# EAGLE design 1Coil (EAGLE 9.2.2)
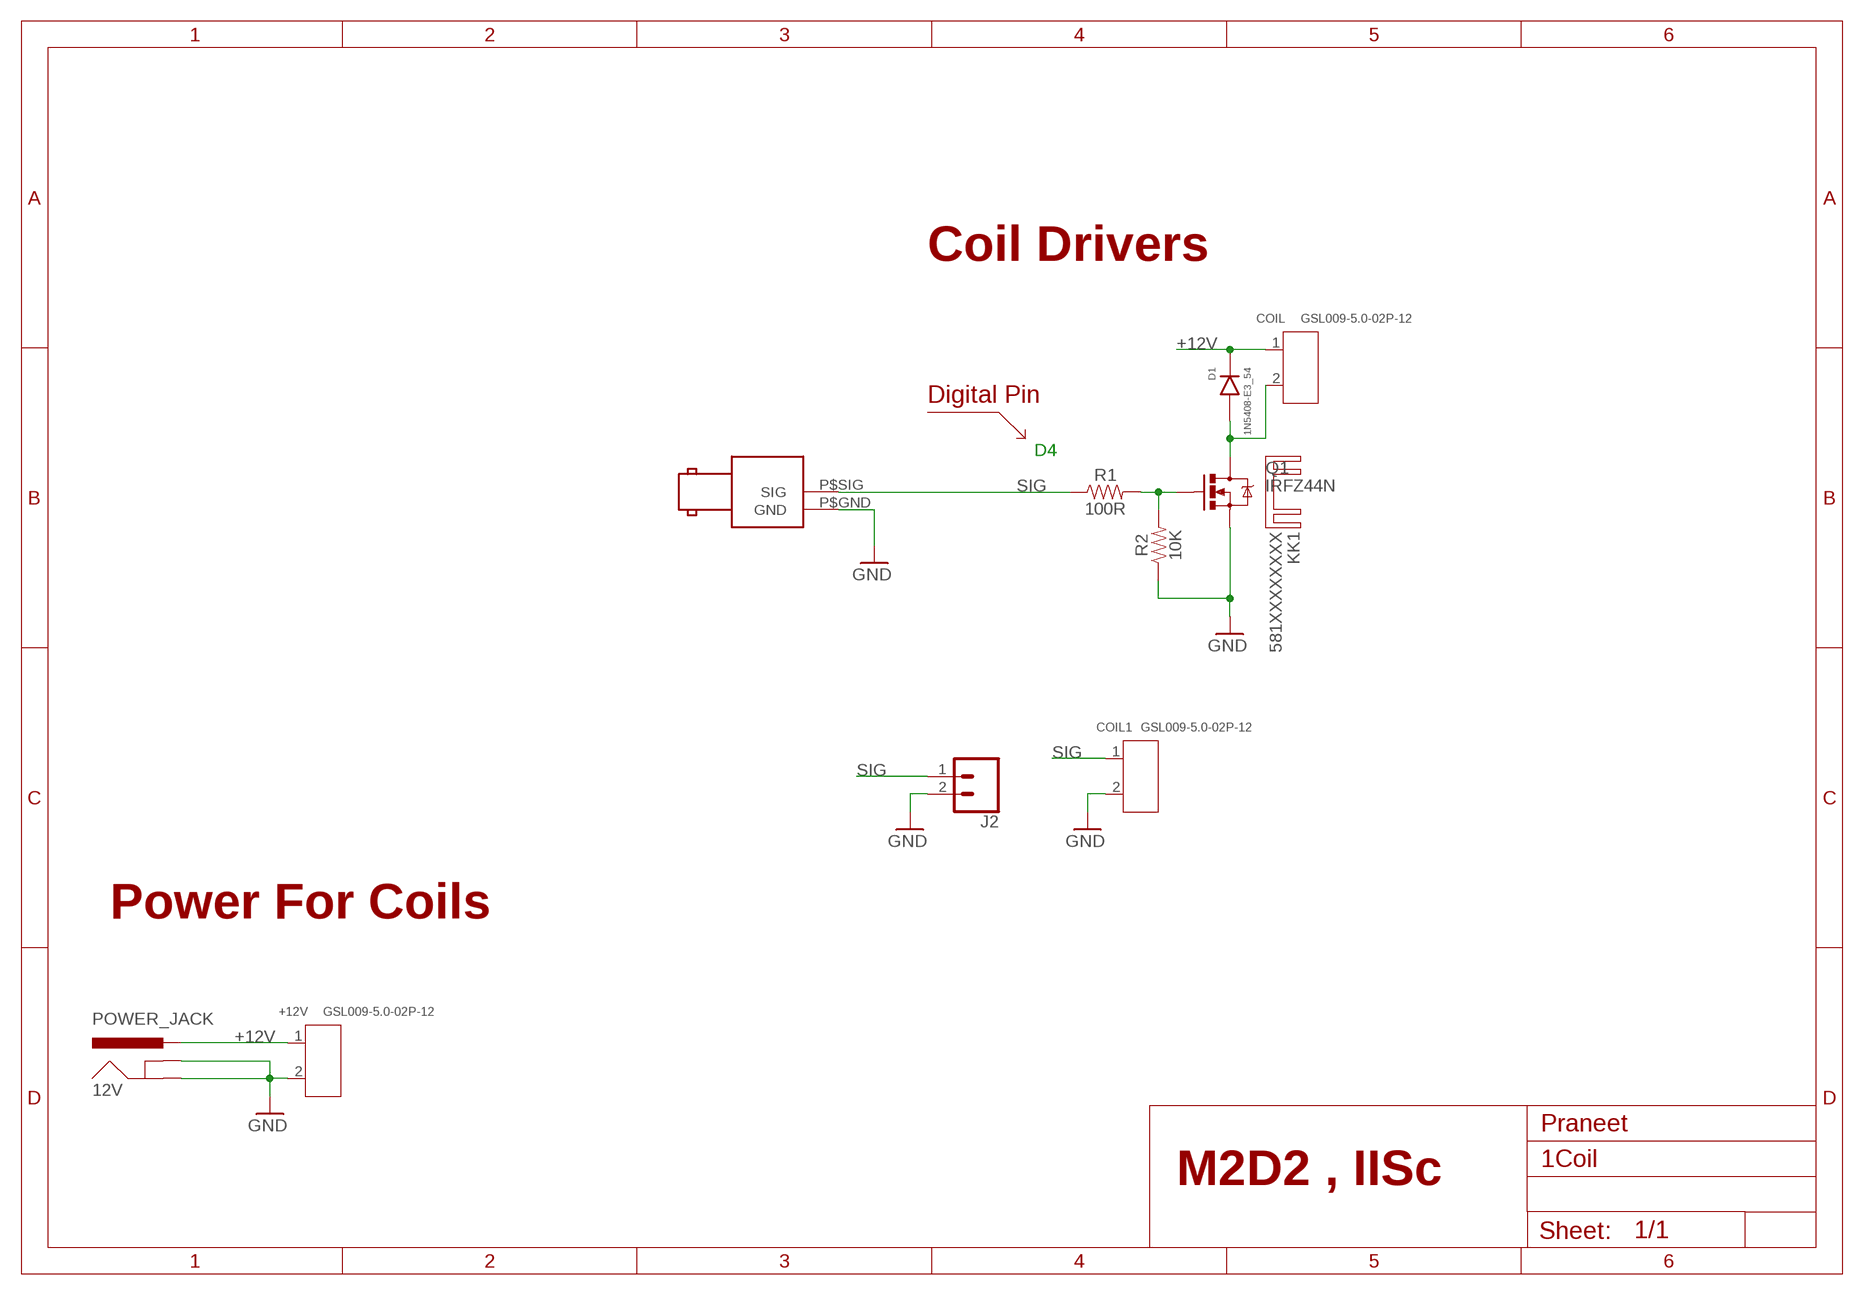
[diagram p0: schematic, sheet 1]

## Parts
12V  POWER_JACK  [POWER_JACK_PTH]
+12V  GSL009-5.0-02P-12  SCREW-TERMINAL-BLUE(2P-5.0)  [H2-5.0-10.5X8.0MM]
BNC  BNC_RIGHT_ANGLE  [BNC_RIGHT_ANGLE]
COIL  GSL009-5.0-02P-12  SCREW-TERMINAL-BLUE(2P-5.0)  [H2-5.0-10.5X8.0MM]
COIL1  GSL009-5.0-02P-12  SCREW-TERMINAL-BLUE(2P-5.0)  [H2-5.0-10.5X8.0MM]
D1  1N5408-E3_54  [DIOAD2855W132L835D505]
J2  CONN_02POLAR  [MOLEX-1X2]
KK1  581XXXXXXXX  [581XXXXXXXX]
Q1  IRFZ44N  [TO-220]
R1  100R  RESISTORAXIAL-0.3  [AXIAL-0.3]
R2  10K  RESISTORAXIAL-0.3  [AXIAL-0.3]

## Nets
+12V: 12V.PWR +12V.1 COIL.1 D1.1(K)
GND [gnd]: 12V.GND 12V.GNDBREAK +12V.2 BNC.P$GND(GND) COIL1.2 J2.2 Q1.3(S) R2.P$1
N$2: COIL.2 D1.2(A) Q1.2(D)
N$4: Q1.1(G) R1.P$2 R2.P$2
SIG: BNC.P$SIG(SIG) COIL1.1 J2.1 R1.P$1

## Notes on the sheet
- Coil Drivers
- Digital Pin
- D4
- Power For Coils
- Praneet
- M2D2 , IISc

## Library data of the parts
12V = SparkFun-Connectors:POWER_JACK: Power Jack Connector This is the standard 5.5mm barrel jack for power. The PTH is the most common, proven, reliable, footprint. The Slot footprint only works if the mill layer is transmitted to the PCB fab house so be warned. Here are the connectors we sell at SparkFun: DC Barrel Power Jack/Connector <https://www.sparkfun.com/products/119> (PRT-00119) DC Barrel Power Jack/Connector (SMD) <https://www.sparkfun.com/products/12748> (PRT-12748) DC Barrel Jack Adapter - Breadboard Compatible <https://www.sparkfun.com/products/10811> (PRT-10811) It is used on this SparkFun product (and many, many others): SparkFun RedBoard - Programmed with Arduino <https://www.sparkfun.com/products/12757> (DEV-12757) Also, if you need a mating power supply or connector, please check these out: Wall Adapter Power Supply - 9VDC 650mA <https://www.sparkfun.com/products/298> (TOL-00298) DC Barrel Jack Adapter - Male <https://www.sparkfun.com/products/10287> (PRT-10287); PROD_ID: CONN-08197
+12V COIL COIL1 = Ei:SCREW-TERMINAL-BLUE(2P-5.0): 320120007; MPN: GSL009-5.0-02P-12
BNC = open-ephys:BNC_RIGHT_ANGLE: BNC plug, through-hole, right-angle
D1 = Ei:1N5408-E3_54: Rectifier Diode 3A 1000V 1.2Vf DO-201AD Vishay 1N5408-E3/54, Diode, 1000V 3A, 2-Pin DO-201AD Source: Datasheet <https://www.vishay.com/docs/88516/1n5400.pdf>; ALLIED_NUMBER: 70217545; ALLIED_PRICE-STOCK: https://www.alliedelec.com/general-semiconductor-vishay-1n5408-e3-54/70217545/; DESCRIPTION: Rectifier Diode 3A 1000V 1.2Vf DO-201AD Vishay 1N5408-E3/54, Diode, 1000V 3A, 2-Pin DO-201AD; HEIGHT: mm; MANUFACTURER_NAME: Vishay; MANUFACTURER_PART_NUMBER: 1N5408-E3/54; MOUSER_PART_NUMBER: 625-1N5408-E3; MOUSER_PRICE-STOCK: https://www.mouser.com/Search/Refine.aspx?Keyword=625-1N5408-E3; RS_PART_NUMBER: 6289502P; RS_PRICE-STOCK: http://uk.rs-online.com/web/p/products/6289502P
J2 = SparkFun-Connectors:CONN_02: Multi connection point. Often used as Generic Header-pin footprint for 0.1 inch spaced/style header connections On any of the 0.1 inch spaced packages, you can populate with these: Break Away Headers - Straight <https://www.sparkfun.com/products/116> (PRT-00116) Break Away Male Headers - Right Angle <https://www.sparkfun.com/products/553> (PRT-00553) Female Headers <https://www.sparkfun.com/products/115> (PRT-00115) Break Away Headers - Machine Pin <https://www.sparkfun.com/products/117> (PRT-00117) Break Away Female Headers - Swiss Machine Pin <https://www.sparkfun.com/products/743> (PRT-00743) For SCREWTERMINALS and SPRING TERMINALS visit here: Screw Terimnals on SparkFun.com <https://www.sparkfun.com/search/results?term=Screw+Terminals> (5mm/3.5mm/2.54mm spacing) This device is also useful as a general connection point to wire up your design to another part of your project. Our various solder wires solder well into these plated through hole pads. Hook-Up Wire - Assortment (Stranded, 22 AWG) <https://www.sparkfun.com/products/11375> (PRT-11375) Hook-Up Wire - Assortment (Solid Core, 22 AWG) <https://www.sparkfun.com/products/11367> (PRT-11367) View the entire wire category on our website here <https://www.sparkfun.com/categories/141> Special notes: Molex polarized connector foot print use with: PRT-08233 with associated crimp pins and housings. 2.54_SCREWTERM for use with PRT-10571. 3.5mm Screw Terminal footprints for PRT-08084 5mm Screw Terminal footprints for use with PRT-08432; SF_ID: PRT-09918
KK1 = Ei:581XXXXXXXX: HEATSINK TO-220/218
Q1 = Ei:IRFZ44N; AVAILABILITY: Unavailable; DESCRIPTION: Transistor NPN Field Effect IRFZ44/IRFZ44N INTERNATIONAL RECTIFIER Ampere=46 V=250 TO220; MF: International Rectifier; MP: IRFZ44N; PACKAGE: TO-220 International Rectifier; PRICE: None
R1 R2 = SparkFun-Resistors:RESISTOR: Generic Resistor Package

## Net classes
0 default: width 0.203 mm, drill 0.406 mm, clearance 0.203 mm
1 power: width 0.61 mm, drill 0.406 mm, clearance 0.203 mm
2 gnd: width 0.305 mm, drill 0.406 mm, clearance 0.203 mm
3 power usb: width 0.508 mm, drill 0.406 mm, clearance 0.203 mm

## Board
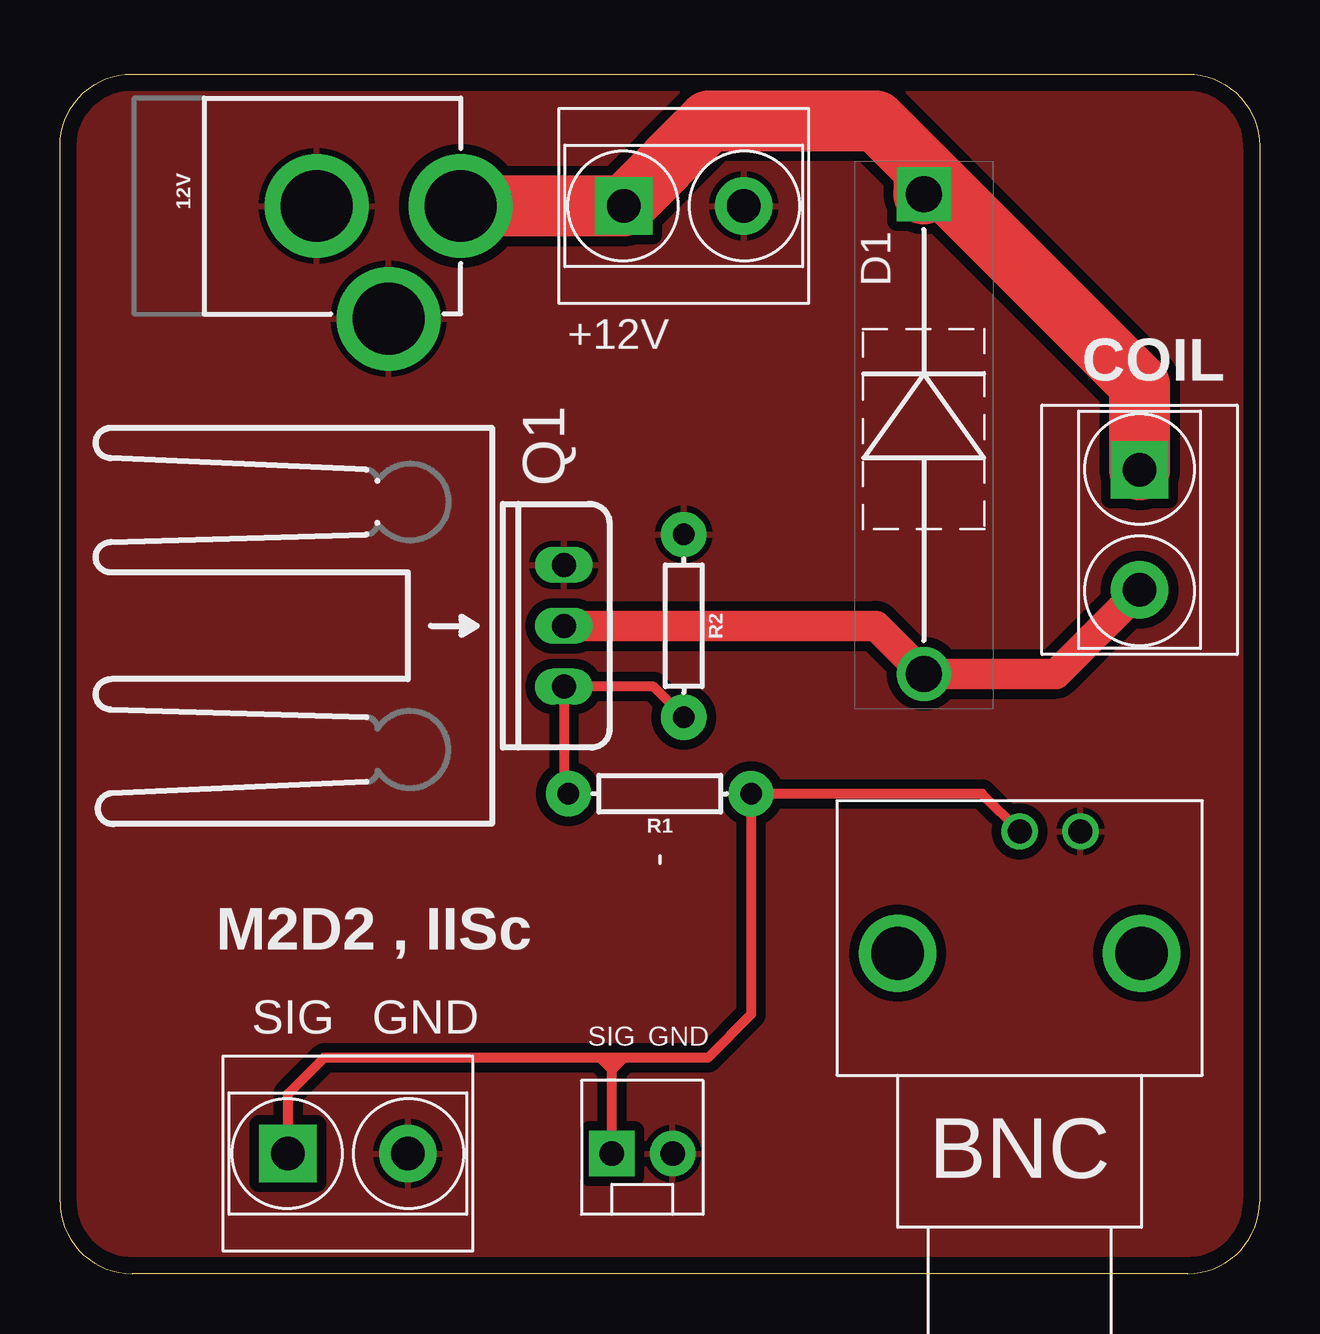
[diagram p1: board, top side]
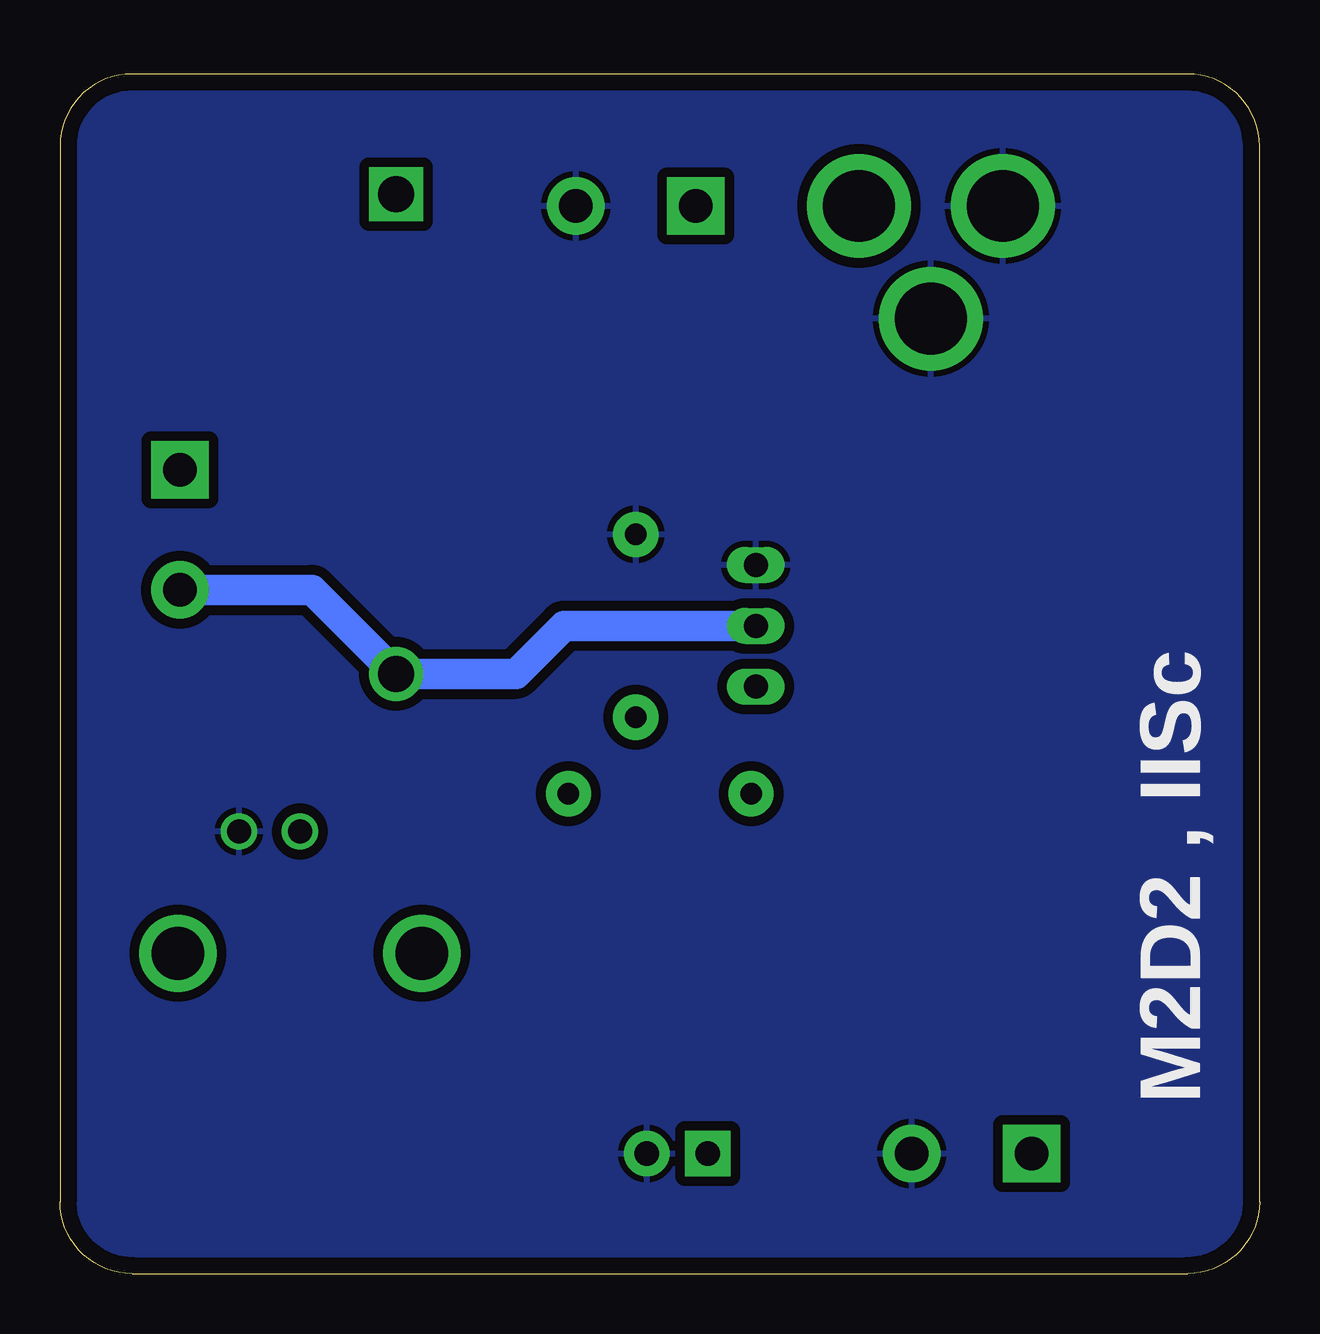
[diagram p2: board, bottom side, seen from below]

Size 50 x 50 mm. Coordinates in mm from the lower left corner, seen from the top.
Outline: 0,3 0,47 arc-90 3,50 47,50 arc-90 50,47 50,3 arc-90 47,0 3,0 arc-90 0,3
Copper layers (1*16): Top 0.035mm / dielectric 1.5mm / Bottom 0.035mm
Design rules "default": minimum track width 8mil, minimum drill 16mil, track to track 7mil, track to pad 7mil, pad to pad 8mil, via to via 10mil, smd to smd 7mil, copper to edge 27mil, drill to drill 12mil, minimum pad ring 10mil, minimum via ring 10mil, stop-mask expansion 2mil, vias tented up to drill 24mil, thermal gap 10mil

### Footprints (pad centres in the part's own frame; a part is rotated, then mirrored left to right if it is on the bottom)
POWER_JACK_PTH = drill 2.997 pad 4.318: GND 0,7.7; GNDBREAK 4.7,10.7; PWR 0,13.7
H2-5.0-10.5X8.0MM = drill 1.4 pad 2.4 square: 1 0,2.5 | drill 1.4 pad 2.4: 2 0,-2.5
BNC_RIGHT_ANGLE = drill 2.2: P$1 -5.08,-6.35; P$2 5.08,-6.35 | drill 1: P$GND -2.54,-11.43; P$SIG 0,-11.43
DIOAD2855W132L835D505 = drill 1.5 pad 2.25 square: 1 0,0 | drill 1.5 pad 2.25: 2 20,0
MOLEX-1X2 = drill 1.016 pad 1.88 square: 1 0,0 | drill 1.016 pad 1.88: 2 2.54,0
TO-220 = drill 1 long: 1 -2.54,0; 2 0,0; 3 2.54,0
AXIAL-0.3 = drill 0.9 pad 1.88: P$1 -3.81,0; P$2 3.81,0

### Placement (x,y rotation side)
12V  3,44.5 270 top
+12V  26,44.5 90 top
BNC  40,7 180 top
COIL  45,31 0 top
COIL1  12,5 90 top
D1  36,45 270 top
J2  23,5 0 top
KK1  18,27 90 top
Q1  21,27 90 top
R1  25,20 180 top
R2  26,27 270 top

### Tracks (layer width: path | path; a pad name or v marks a point on that pad's centre or on a via)
+12V
  Top 2.54: 12V.PWR +12V.1 27.04,48.04 34,48.04 36,46.04 | 36,46.04 D1.1 | COIL.1 45,37.04 36,46.04
GND
  pour Top (isolate 0.406): -1,-1 -1,51 51,51 51,-1
  pour Bottom (isolate 0.406): -2,-2 -2,52 52,52 52,-2
N$2
  Top 1.27: Q1.2 34,27 D1.2 41.5,25 COIL.2
  Bottom 1.27: Q1.2 29,27 31,25 D1.2 39.5,28.5 COIL.2
N$4
  Top 0.406: R1.P$2 21,20.19 Q1.1 24.73,24.46 R2.P$2
SIG
  Top 0.406: COIL1.1 9.5,7.5 11,9 22.5,9 | 23.5,9 27,9 28.81,10.81 R1.P$1 38.43,20 BNC.P$SIG | 23.5,9 23,9 | 23,9 22.5,9 | J2.1 23,8.5 | 23,8.5 23,9 | 23.5,9 23,8.5 | 23,8.5 22.5,9

### Text on the board
tPlace: M2D2 , IISc | SIG | GND | SIG | GND
bPlace: M2D2 , IISc